# EAGLE schematic Small e-PaperShield v2.1 (EAGLE 6.4)
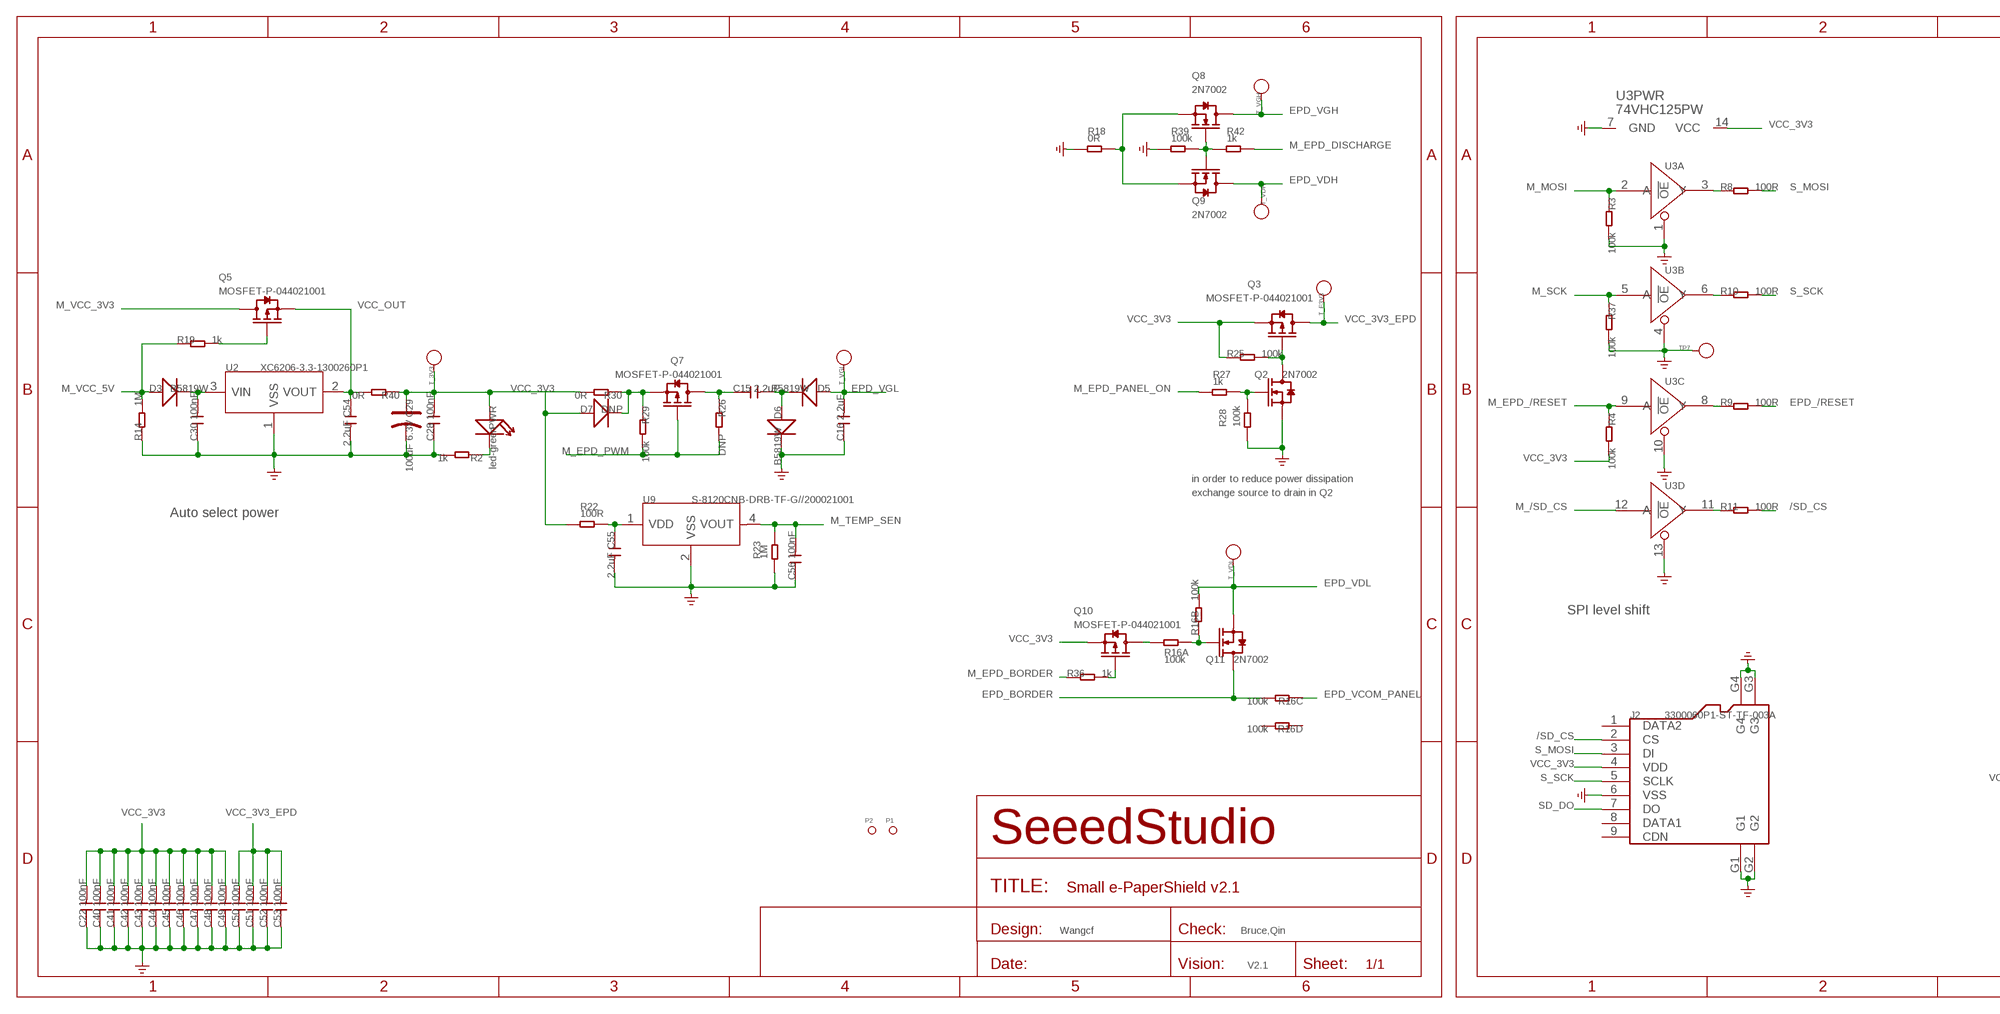
[diagram p0: schematic, sheet 1, part 1 of 2]
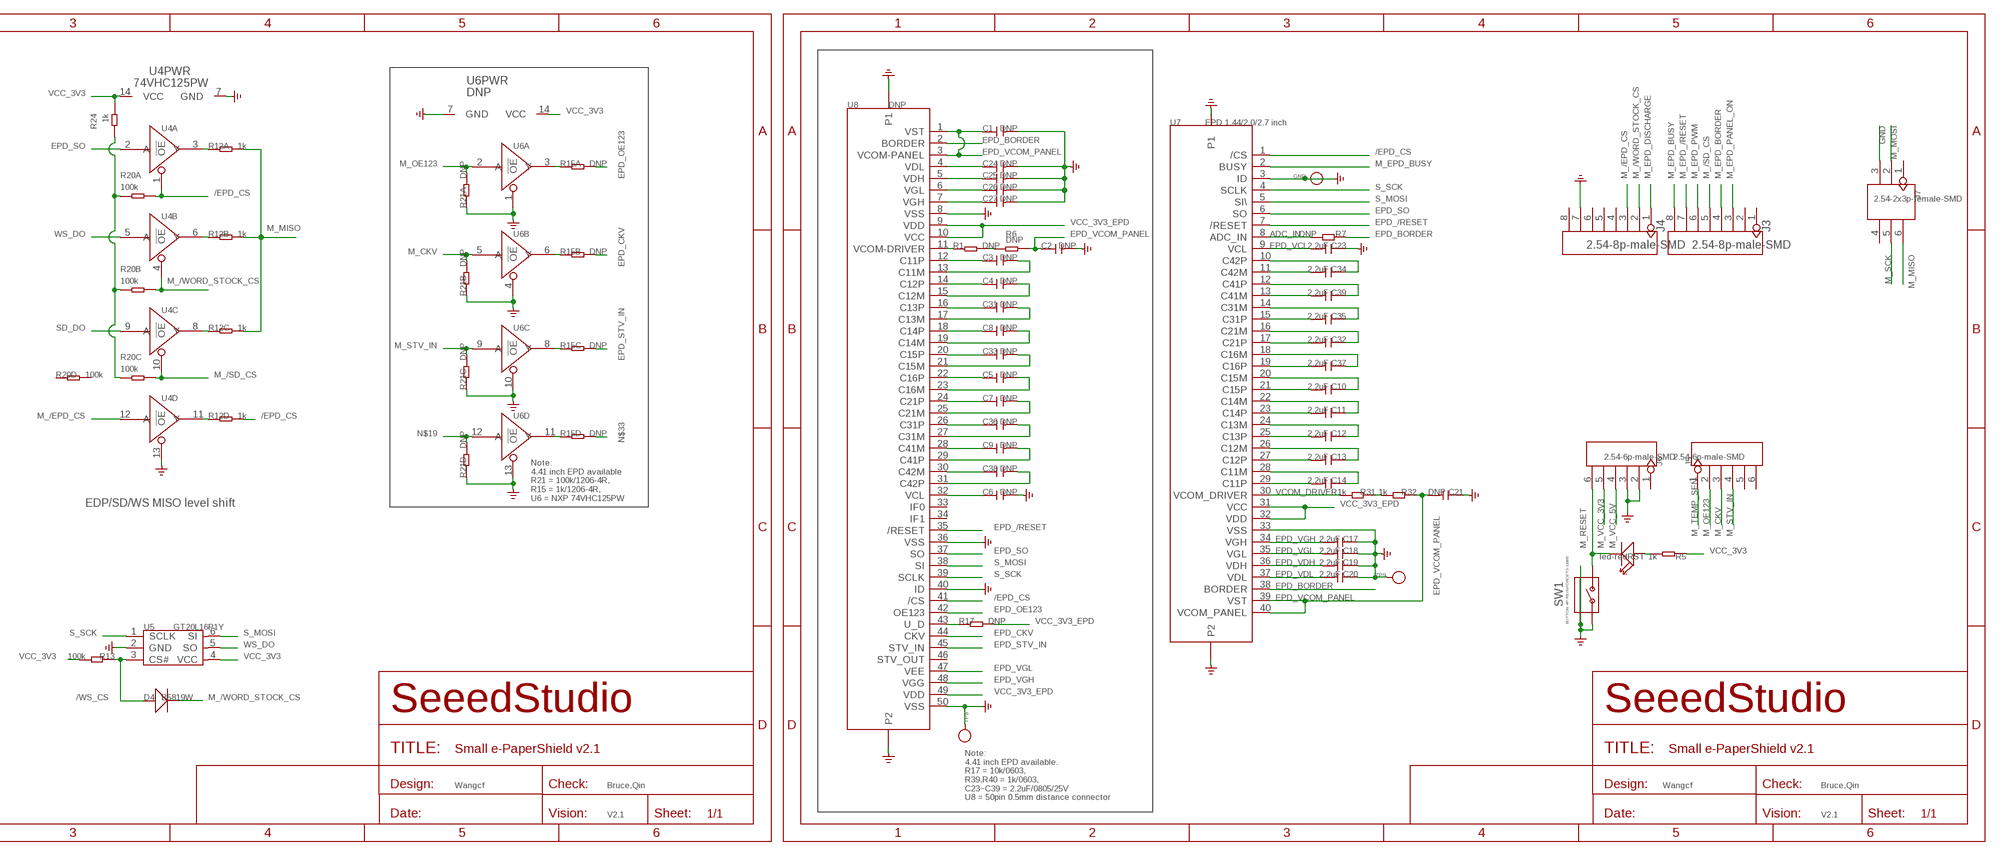
[diagram p1: schematic, sheet 1, part 2 of 2]

## Parts
C1  DNP  C-0805  [C0805]
C2  DNP  C-0805  [C0805]
C3  DNP  C-0805  [C0805]
C4  DNP  C-0805  [C0805]
C5  DNP  C-0805  [C0805]
C6  DNP  C-0805  [C0805]
C7  DNP  C-0805  [C0805]
C8  DNP  C-0805  [C0805]
C9  DNP  C-0805  [C0805]
C10  2.2uF  C-0805  [C0805]
C11  2.2uF  C-0805  [C0805]
C12  2.2uF  C-0805  [C0805]
C13  2.2uF  C-0805  [C0805]
C14  2.2uF  C-0805  [C0805]
C15  2.2uF  C-0805  [C0805]
C16  2.2uF  C-0805  [C0805]
C17  2.2uF  C-0805  [C0805]
C18  2.2uF  C-0805  [C0805]
C19  2.2uF  C-0805  [C0805]
C20  2.2uF  C-0805  [C0805]
C21  DNP  C-0805  [C0805]
C22  100nF  C-0603  [C0603]
C23  2.2uF  C-0805  [C0805]
C24  DNP  C-0805  [C0805]
C25  DNP  C-0805  [C0805]
C26  DNP  C-0805  [C0805]
C27  DNP  C-0805  [C0805]
C28  100nF  C-0603  [C0603]
C29  100uF 6.3V  CAP-AVX-B  [AVX-B]
C30  100nF  C-0603  [C0603]
C31  DNP  C-0805  [C0805]
C32  2.2uF  C-0805  [C0805]
C33  DNP  C-0805  [C0805]
C34  2.2uF  C-0805  [C0805]
C35  2.2uF  C-0805  [C0805]
C36  DNP  C-0805  [C0805]
C37  2.2uF  C-0805  [C0805]
C38  DNP  C-0805  [C0805]
C39  2.2uF  C-0805  [C0805]
C40  100nF  C-0603  [C0603]
C41  100nF  C-0603  [C0603]
C42  100nF  C-0603  [C0603]
C43  100nF  C-0603  [C0603]
C44  100nF  C-0603  [C0603]
C45  100nF  C-0603  [C0603]
C46  100nF  C-0603  [C0603]
C47  100nF  C-0603  [C0603]
C48  100nF  C-0603  [C0603]
C49  100nF  C-0603  [C0603]
C50  100nF  C-0603  [C0603]
C51  100nF  C-0603  [C0603]
C52  100nF  C-0603  [C0603]
C53  100nF  C-0603  [C0603]
C54  2.2uF  C-0805  [C0805]
C55  2.2uF  C-0805  [C0805]
C56  100nF  C-0603  [C0603]
D3  B5819W  D'1206'  [SOD123]
D4  B5819W  D'1206'  [SOD123]
D5  B5819W  D'1206'  [SOD123]
D6  B5819W  D'1206'  [SOD123]
D7  DNP  D'1206'  [SOD123]
GND  PAD-TEST-POINT'3535'  [TP_3535]
J2  3300060P1-ST-TF-003A  [9P-SMD-W/-RING]
J3  2.54-8p-male-SMD  HEADER-8P-2.54-SMD  [8P-2.54-SMD]
J4  2.54-8p-male-SMD  HEADER-8P-2.54-SMD  [8P-2.54-SMD]
J5  2.54-6p-male-SMD  HEADER-6P-SMD  [6P-2.54-SMD]
J6  2.54-6p-male-SMD  HEADER-6P-SMD  [6P-2.54-SMD]
J7  2.54-2x3p-female-SMD  HEADER-2X3P-SMD  [2X3P-2.54-SMD]
P1  PAD-MARK  [ROUND-MARK-1.0]
P2  PAD-MARK  [ROUND-MARK-1.0]
PWR  led-green  LED'RIGHT'  [LED-SIDE-VIEW-0603-RIGHT]
Q2  2N7002  MOSFET-N'SOT23'  [SOT23]
Q3  MOSFET-P-044021001  [SOT23]
Q5  MOSFET-P-044021001  [SOT23]
Q7  MOSFET-P-044021001  [SOT23]
Q8  2N7002  MOSFET-N'SOT23'  [SOT23]
Q9  2N7002  MOSFET-N'SOT23'  [SOT23]
Q10  MOSFET-P-044021001  [SOT23]
Q11  2N7002  MOSFET-N'SOT23'  [SOT23]
R1  DNP  R-0603  [R0603]
R2  1k  R-0603  [R0603]
R3  100k  R-0603  [R0603]
R4  100k  R-0603  [R0603]
R5  1k  R-0603  [R0603]
R6  DNP  R-0603  [R0603]
R7  DNP  R-0603  [R0603]
R8  100R  R-0603  [R0603]
R9  100R  R-0603  [R0603]
R10  100R  R-0603  [R0603]
R11  100R  R-0603  [R0603]
R12  1k  R-4R-1206  [1206-8-3.3X2.4]
R13  100k  R-0603  [R0603]
R14  1M  R-0603  [R0603]
R15  DNP  R-4R-1206  [1206-8-3.3X2.4]
R16  100k  R-4R-1206  [1206-8-3.3X2.4]
R17  DNP  R-0603  [R0603]
R18  0R  R-0603  [R0603]
R19  1k  R-0603  [R0603]
R20  100k  R-4R-1206  [1206-8-3.3X2.4]
R21  DNP  R-4R-1206  [1206-8-3.3X2.4]
R22  100R  R-0603  [R0603]
R23  1M  R-0603  [R0603]
R24  1k  R-0603  [R0603]
R25  100k  R-0603  [R0603]
R26  DNP  R-0603  [R0603]
R27  1k  R-0603  [R0603]
R28  100k  R-0603  [R0603]
R29  100k  R-0603  [R0603]
R30  0R  R-0603  [R0603]
R31  1k  R-0603  [R0603]
R32  1k  R-0603  [R0603]
R36  1k  R-0603  [R0603]
R37  100k  R-0603  [R0603]
R39  100k  R-0603  [R0603]
R40  0R  R-0603  [R0603]
R42  1k  R-0603  [R0603]
RST  led-red  LED'RIGHT'  [LED-SIDE-VIEW-0603-RIGHT]
SW1  BUTTON-4P-REINFORCE'TS-1188E'  [4P-SMD-7X3.5X3.5H]
T_3V3  PAD-TEST-POINT'3535'  [TP_3535]
T_E3V3  PAD-TEST-POINT'3535'  [TP_3535]
T_VDH  PAD-TEST-POINT'3535'  [TP_3535]
T_VDL  PAD-TEST-POINT'3535'  [TP_3535]
T_VGH  PAD-TEST-POINT'3535'  [TP_3535]
T_VGL  PAD-TEST-POINT'3535'  [TP_3535]
TP7  PAD-TEST-POINT'3535'  [TP_3535]
TP8  PAD-TEST-POINT'3535'  [TP_3535]
TP9  PAD-TEST-POINT'3535'  [TP_3535]
U2  XC6206-3.3-1300260P1  [SOT23]
U3  74VHC125PW  [TSSOP14]
U4  74VHC125PW  [TSSOP14]
U5  GT20L16P1Y  [SOT23-6]
U6  DNP  74VHC125PW  [TSSOP14]
U7  EPD 1.44/2.0/2.7 inch  TFT-EPD-PANEL  [40P-0.5]
U8  DNP  TFT-EPD-PANEL  [50P-0.5]
U9  S-8120CNB-DRB-TF-G//200021001  S-8110C/8120C  [SC-82AB]

## Nets
3V3_LOG: R20.1 R20.2 R20.3 R24.2
/EPD_CS: R12.5 R20.8 U4.1(A:!OE) U7.1(/CS) U8.41(/CS)
/SD_CS: J2.2(CS) R11.2
/WS_CS: D4.+ R13.1 U5.3(CS#)
ADC_IN: R7.2 U7.8(ADC_IN)
EPD_/RESET: R9.2 U7.7(/RESET) U8.35(/RESET)
EPD_BORDER: Q11.3(D) R7.1 R16.6 U7.38(BORDER) U8.2(BORDER)
EPD_CKV: R15.7 U8.44(CKV)
EPD_OE123: R15.8 U8.42(OE123)
EPD_SO: U4.2(A:A) U7.6(SO) U8.37(SO)
EPD_STV_IN: R15.6 U8.45(STV_IN)
EPD_VCL: C23.2 U7.9(VCL)
EPD_VCOM_PANEL: C1.1 C2.1 C21.2 R6.2 R16.3 R32.1 U7.39(VST) U7.40(VCOM_PANEL) U8.1(VST) U8.3(VCOM-PANEL)
EPD_VDH: C19.2 C25.1 Q9.3(D) T_VDH.T U7.36(VDH) U8.5(VDH)
EPD_VDL: C20.2 C24.1 Q11.2(S) R16.7 T_VDL.T U7.37(VDL) U8.4(VDL)
EPD_VGH: C17.2 C27.1 Q8.3(D) T_VGH.T U7.34(VGH) U8.7(VGH) U8.48(VGG)
EPD_VGL: C16.2 C18.2 C26.1 D5.+ T_VGL.T U7.35(VGL) U8.6(VGL) U8.47(VEE)
GND: C1.2 C2.2 C6.2 C16.1 C17.1 C18.1 C19.1 C20.1 C21.1 C22.1 C23.1 C24.2 C25.2 C26.2 C27.2 C28.1 C29.- C30.1 C40.1 C41.1 C42.1 C43.1 C44.1 C45.1 C46.1 C47.1 C48.1 C49.1 C50.1 C51.1 C52.1 C53.1 C54.2 C55.2 C56.1 D6.- GND.T J2.6(VSS) J2.G1 J2.G2 J2.G3 J2.G4 J4.7 J6.2 J6.3 J7.3 Q2.2(S) R2.2 R3.2 R14.1 R18.1 R21.1 R21.2 R21.3 R21.4 R23.1 R28.1 R37.2 R39.1 SW1.1 SW1.S1 SW1.S2 TP7.T TP8.T TP9.T U2.1(VSS) U3.1(A:!OE) U3.4(B:!OE) U3.7(PWR:GND) U3.10(C:!OE) U3.13(D:!OE) U4.7(PWR:GND) U4.13(D:!OE) U5.2(GND) U6.1(A:!OE) U6.4(B:!OE) U6.7(PWR:GND) U6.10(C:!OE) U6.13(D:!OE) U7.3(ID) U7.33(VSS) U7.P1 U7.P2 U8.8(VSS) U8.36(VSS) U8.40(ID) U8.50(VSS) U8.P1 U8.P2 U9.2(VSS)
M_/EPD_CS: J4.3 U4.12(D:A)
M_/SD_CS: J3.5 R20.6 U3.12(D:A) U4.10(C:!OE)
M_/WORD_STOCK_CS: D4.- J4.2 R20.7 U4.4(B:!OE)
M_CKV: J5.3 R21.7 U6.5(B:A)
M_EPD_/RESET: J3.7 R4.1 U3.9(C:A)
M_EPD_BORDER: J3.4 R36.1
M_EPD_BUSY: J3.8 U7.2(BUSY)
M_EPD_DISCHARGE: J4.1 R42.2
M_EPD_PANEL_ON: J3.3 R27.1
M_EPD_PWM: J3.6 Q7.1(G) R26.2 R29.2
M_MISO: J7.6 R12.6 R12.7 R12.8
M_MOSI: J7.2 R3.1 U3.2(A:A)
M_OE123: J5.2 R21.8 U6.2(A:A)
M_RESET: J6.6 RST.2(-) SW1.2
M_SCK: J7.5 R37.1 U3.5(B:A)
M_STV_IN: J5.4 R21.6 U6.9(C:A)
M_TEMP_SEN: C56.2 J5.1 R23.2 U9.4(VOUT)
M_VCC_3V3: J6.5 Q5.3(D)
M_VCC_5V: D3.+ J6.4 R14.2 R19.1
N$1: PWR.2(-) R2.1
N$2: Q5.1(G) R19.2
N$3: C15.2 D5.- D6.+
N$4: D7.- Q7.2(S) R29.1 R30.1
N$6: Q2.1(G) R27.2 R28.2
N$7: R11.1 U3.11(D:Y)
N$8: C30.2 D3.- U2.3(VIN)
N$9: C15.1 Q7.3(D) R26.1
N$10: Q8.1(G) Q9.1(G) R39.2 R42.1
N$11: Q2.3(D) Q3.1(G) R25.2
N$12: R31.1 R32.2
N$13: Q10.3(D) R16.1
N$14: Q10.1(G) R36.2
N$15: C4.1 U8.14(C12P)
N$16: Q8.2(S) Q9.2(S) R18.2
N$19: R21.5 U6.12(D:A)
N$20: R12.1 U4.3(A:Y)
N$21: R12.2 U4.6(B:Y)
N$22: R12.3 U4.8(C:Y)
N$23: R15.1 U6.3(A:Y)
N$24: R15.3 U6.8(C:Y)
N$25: R15.4 U6.11(D:Y)
N$26: R15.2 U6.6(B:Y)
N$27: R12.4 U4.11(D:Y)
N$28: Q11.1(G) R16.2 R16.8
N$30: R1.2 R6.1
N$33: R15.5
N$34: C34.1 U7.10(C42P)
N$35: C34.2 U7.11(C42M)
N$36: C39.1 U7.12(C41P)
N$37: C39.2 U7.13(C41M)
N$39: C4.2 U8.15(C12M)
N$40: C3.1 U8.12(C11P)
N$41: C31.2 U8.17(C13M)
N$42: C31.1 U8.16(C13P)
N$43: C8.1 U8.18(C14P)
N$44: C8.2 U8.19(C14M)
N$45: C33.2 U8.21(C15M)
N$46: C33.1 U8.20(C15P)
N$47: C5.1 U8.22(C16P)
N$48: C5.2 U8.23(C16M)
N$49: C7.1 U8.24(C21P)
N$50: C7.2 U8.25(C21M)
N$51: C36.1 U8.26(C31P)
N$52: C36.2 U8.27(C31M)
N$53: C9.1 U8.28(C41M)
N$54: C9.2 U8.29(C41P)
N$55: C38.1 U8.30(C42M)
N$56: C38.2 U8.31(C42P)
N$57: C6.1 U8.32(VCL)
N$58: R1.1 U8.11(VCOM-DRIVER)
N$67: R17.1 U8.43(U_D)
N$74: R8.1 U3.3(A:Y)
N$76: R10.1 U3.6(B:Y)
N$80: R9.1 U3.8(C:Y)
N$81: C35.1 U7.14(C31M)
N$82: C3.2 U8.13(C11M)
N$85: C35.2 U7.15(C31P)
N$87: R5.2 RST.1(+)
N$88: C32.1 U7.16(C21M)
N$89: C32.2 U7.17(C21P)
N$90: C37.1 U7.18(C16M)
N$91: C37.2 U7.19(C16P)
N$92: C10.1 U7.20(C15M)
N$93: C10.2 U7.21(C15P)
N$94: C11.1 U7.22(C14M)
N$95: C11.2 U7.23(C14P)
N$96: C12.1 U7.24(C13M)
N$97: C12.2 U7.25(C13P)
N$98: C13.1 U7.26(C12M)
N$99: C13.2 U7.27(C12P)
N$100: C14.1 U7.28(C11M)
N$101: C14.2 U7.29(C11P)
S_MOSI: J2.3(DI) R8.2 U5.6(SI) U7.5(SI\) U8.38(SI)
S_SCK: J2.5(SCLK) R10.2 U5.1(SCLK) U7.4(SCLK) U8.39(SCLK)
SD_DO: J2.7(DO) U4.9(C:A)
VCC_3V3: C22.2 C28.2 C29.+ C40.2 C41.2 C42.2 C43.2 C44.2 C45.2 C46.2 C47.2 C48.2 C49.2 D7.+ J2.4(VDD) PWR.1(+) Q3.2(S) Q10.2(S) R4.2 R5.1 R13.2 R22.1 R24.1 R25.1 R30.2 R40.1 T_3V3.T U3.14(PWR:VCC) U4.14(PWR:VCC) U5.4(VCC) U6.14(PWR:VCC)
VCC_3V3_EPD: C50.2 C51.2 C52.2 C53.2 Q3.3(D) R17.2 T_E3V3.T U7.31(VCC) U7.32(VDD) U8.9(VDD) U8.10(VCC) U8.49(VDD)
VCC_OUT: C54.1 Q5.2(S) R40.2 U2.2(VOUT)
VCOM_DRIVER: R31.2 U7.30(VCOM_DRIVER)
VDD: C55.1 R22.2 U9.1(VDD)
WS_DO: U4.5(B:A) U5.5(SO)
Unconnected: J2.1(DATA2) J2.8(DATA1) J2.9(CDN) J3.1 J3.2 J4.4 J4.5 J4.6 J4.8 J5.5 J5.6 J6.1 J7.1 J7.4 R16.4 R16.5 R20.4 R20.5 U8.33(IF0) U8.34(IF1) U8.46(STV_OUT)

## Notes on the sheet
- in order to reduce power dissipation
- exchange source to drain in Q2
- Auto select power
- Note:
  4.41 inch EPD available
  R21 = 100k/1206-4R,
  R15 = 1k/1206-4R,
  U6 = NXP 74VHC125PW
- EDP/SD/WS MISO level shift
- SPI level shift
- Wangcf | Bruce,Qin | Wangcf | Bruce,Qin | Wangcf | Bruce,Qin
- Note:
  4.41 inch EPD available.
  R17 = 10k/0603, 
  R39,R40 = 1k/0603, 
  C23~C39 = 2.2uF/0805/25V
  U8 = 50pin 0.5mm distance connector
- V2.1 | V2.1 | V2.1

## Library data of the parts
C1-C28 C30-C56 = Discrete:C*: Ceramic Capacitors
C29 = Discrete:CAP*: Electrolytic Capacitors,Tantalum Capacitors and Super Capacitors
D3-D7 = Discrete:D*
GND T_3V3 T_E3V3 T_VDH T_VDL T_VGH T_VGL TP7-TP9 = Discrete:PAD-TEST-POINT; PARTNO: DNP
J2 = OPL-NEW:3300060P1-ST-TF-003A: Micro SD Card
J3 J4 = Connector:HEADER-8P
J5 J6 = Connector:HEADER-6P
J7 = Connector:HEADER-2X3P
P1 P2 = Discrete:PAD-MARK; PARTNO: DNP
PWR RST = Discrete:LED*
Q2 Q8 Q9 Q11 = Discrete:MOSFET-N: IRLL014: http://www.vishay.com/docs/91319/sihll014.pdf
Q3 Q5 Q7 Q10 = OPL:MOSFET-P: CJ2305：SMD MOSFET P-CH 8V-4.1A
R1-R11 R13 R14 R17-R19 R22-R32 R36 R37 R39 R40 R42 = Discrete:R*
R12 R15 R16 R20 R21 = Discrete:R-4R*: Resistor Array
SW1 = Discrete:BUTTON-4P-REINFORCE: TS-1188E http://www.best-dz.com/?thread-374-2.html
U2 = OPL:XC6206-3.3: LOW ESR Cap.Compatible Positive Voltage Regulators
U3 U4 U6 = IC:74V*125: Quad Buffer/Line Driver;3-state
U5 = template:GT20L16P1Y
U7 = moudle:TFT-EPD-PANEL: 1.44inch/2.0inch/2.7inch TFT EPD Panel
U8 = template:TFT-EPD-PANEL: 4.4inch TFT EPD PANEL
U9 = template:S-8110C/8120C: COMS Temperature Sensor IC

## Net classes
0 default: width 0.152 mm, drill 0.305 mm, clearance 0.152 mm